# Altium schematic sheet Interface.SchDoc
size A4
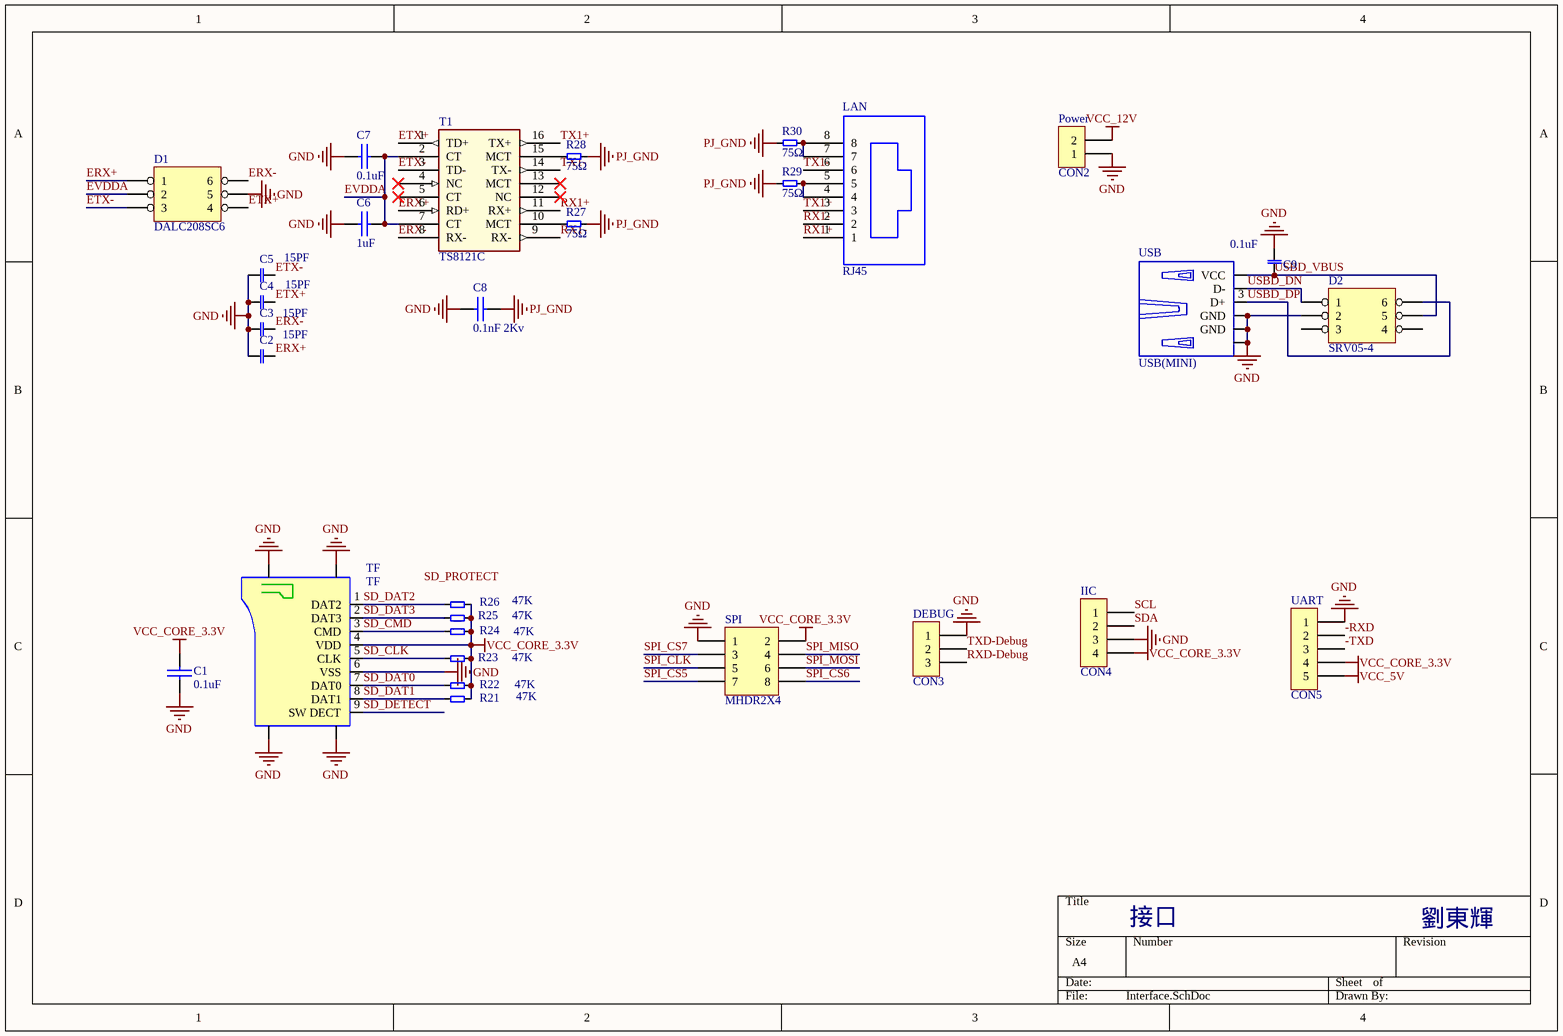
[diagram p0: Interface.SchDoc]

## Parts
C1  0.1uF  [0805/2012 C3]
C2  15PF  [0805/2012 C3]
C3  15PF  [0805/2012 C3]
C4  15PF  [0805/2012 C3]
C5  15PF  [0805/2012 C3]
C6  1uF  [0805/2012 C3]
C7  0.1uF  [0805/2012 C3]
C8  0.1nF 2Kv  [CAPRR508-350X650X700]
C9  0.1uF  [0805/2012 C3]
D1  DALC208SC6  [TSOT-23_6]
D2  SRV05-4  [TSOT-23_6]
DEBUG  CON3  [COMATEL_385.0358.1.03.400]
IIC  CON4  [COMATEL_385.0358.1.04.400]
LAN  RJ45  [RJ45_8P_8C]
Power  CON2  [B2P-VH]
R21  47K  [0805/2012 R3]
R22  47K  [0805/2012 R3]
R23  47K  [0805/2012 R3]
R24  47K  [0805/2012 R3]
R25  47K  [0805/2012 R3]
R26  47K  [0805/2012 R3]
R27  75Ω  [0805/2012 R3]
R28  75Ω  [0805/2012 R3]
R29  75Ω  [0805/2012 R3]
R30  75Ω  [0805/2012 R3]
SPI  MHDR2X4  [M20N-2X04-2.54]
T1  TS8121C  [XFMR_PULSE_H1260NL]
TF  TF  [TFP09-2-12B-G]
UART  CON5  [COMATEL_386.0358.1.05.440]
USB  USB(MINI)  [WURTH_651005136521]

## Nets
GND: C1.2 C2.2 C3.2 C4.1 C5.2 C6.1 C7.1 C8.2 C9.1 D1.5 D2.2 DEBUG.1 IIC.3 Power.1 SPI.1 TF.6(VSS) TF.10(GND) TF.11(GND) TF.12(GND) TF.13(GND) UART.1 USB.4(GND) USB.5(GND) USB.6
PJ_GND: C8.1 LAN.0(GND) R27.2 R28.2 R29.1 R30.1
VCC_5V: UART.5
VCC_12V: Power.2
VCC_CORE_3.3V: C1.1 IIC.4 R21.2 R22.2 R23.2 R24.2 R25.2 R26.2 SPI.2 TF.4(VDD) UART.4
-RXD: UART.2
-TXD: UART.3
ERX+: C2.1 D1.1 T1.6(RD+)
ERX-: C3.1 D1.6 T1.8(RX-)
ETX+: C4.2 D1.4 T1.1(TD+)
ETX-: C5.1 D1.3 T1.3(TD-)
EVDDA: C6.2 C7.2 D1.2 T1.2(CT) T1.7(CT)
RX1+: LAN.1 T1.11(RX+)
RX1-: LAN.2 T1.9(RX-)
RXD-Debug: DEBUG.3
SCL: IIC.1
SD_CLK: R23.1 TF.5(CLK)
SD_CMD: R24.1 TF.3(CMD)
SD_DAT0: R22.1 TF.7(DAT0)
SD_DAT1: R21.1 TF.8(DAT1)
SD_DAT2: R26.1 TF.1(DAT2)
SD_DAT3: R25.1 TF.2(DAT3)
SD_DETECT: TF.9(SW_DECT)
SDA: IIC.2
SPI_CLK: SPI.5
SPI_CS5: SPI.7
SPI_CS6: SPI.8
SPI_CS7: SPI.3
SPI_MISO: SPI.4
SPI_MOSI: SPI.6
TX1+: LAN.3 T1.16(TX+)
TX1-: LAN.6 T1.14(TX-)
TXD-Debug: DEBUG.2
USBD_DN: D2.1 USB.2(D-)
USBD_DP: D2.6 USB.3(D+)
USBD_VBUS: C9.2 D2.5 USB.1(VCC)
NetLAN_4: LAN.4 LAN.5 R29.2
NetLAN_7: LAN.7 LAN.8 R30.2
NetR27_1: R27.1 T1.10(MCT)
NetR28_1: R28.1 T1.15(MCT)

Not connected (* = marked no-connect by the designer): D2 3 4; T1 4(NC)* 5(CT)* 12(NC)* 13(MCT)*

## Notes on the sheet
- 接口
- 劉東輝
- Labels drawn without touching a wire or pin: SD_PROTECT

## Library data of the parts
C1 C6-C8 = Pro39.tmp_22P_32
C2-C5 C9 = CAP: Capacitor
D1 D2 = HEADER 3X2
DEBUG = CON3: Connector
IIC = CON4: Connector
Power = CON2: Connector
R21-R30 = RES2: Resistor
SPI = MHDR2X4: Header, 4-Pin, Dual row
UART = CON5: Connector
USB = USB(MINI): USB-MINI